# EAGLE design usb2hkx_v1.0 (EAGLE 6.6.0)
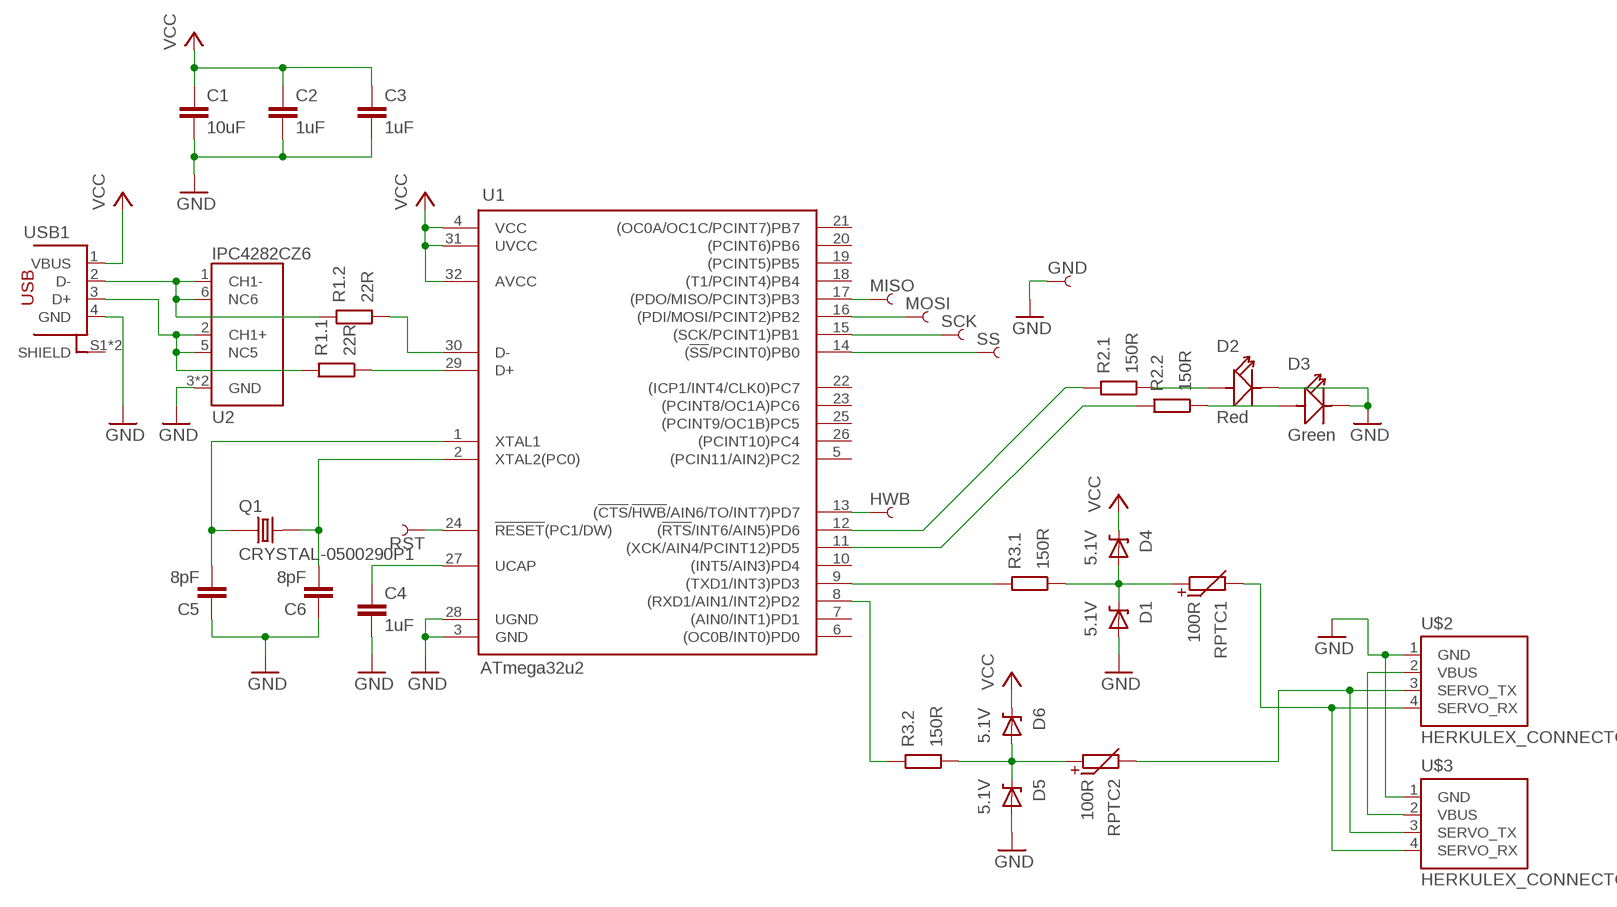
[diagram p0: schematic, sheet 1]

## Parts
C1  10uF  C0805_L  [0805_L]
C2  1uF  C0402  [0402_N]
C3  1uF  C0402  [0402_N]
C4  1uF  C0402  [0402_N]
C5  8pF  C0402  [0402_N]
C6  8pF  C0402  [0402_N]
D1  5.1V  DIODE_ZENER-923  [SOD-923_N]
D2  Red  LED  [LED0603]
D3  Green  LED  [LED0603]
D4  5.1V  DIODE_ZENER-923  [SOD-923_N]
D5  5.1V  DIODE_ZENER-923  [SOD-923_N]
D6  5.1V  DIODE_ZENER-923  [SOD-923_N]
GND  PIN_SMD_2X2.5  [PIN_SMD_2X2.5]
HWB  PIN_SMD_2X2.5  [PIN_SMD_2X2.5]
MISO  PIN_SMD_2X2.5  [PIN_SMD_2X2.5]
MOSI  PIN_SMD_2X2.5  [PIN_SMD_2X2.5]
Q1  CRYSTAL-0500290P1  [2P-SMD-5.0X3.2]
R1  22R  R_2-0402  [ARRAY_0402_65P_2_N]
R2  150R  R_2-0402  [ARRAY_0402_65P_2_N]
R3  150R  R_2-0402  [ARRAY_0402_65P_2_N]
RPTC1  100R  R-PTC0603  [0603_N]
RPTC2  100R  R-PTC0603  [0603_N]
RST  PIN_SMD_2X2.5  [PIN_SMD_2X2.5]
SCK  PIN_SMD_2X2.5  [PIN_SMD_2X2.5]
SS  PIN_SMD_2X2.5  [PIN_SMD_2X2.5]
U1  ATmega32u2  IC_ATMEGAXXU2-MU_L_MOD  [QFN-32_50P_L_MOD]
U2  IPC4282CZ6  [XSON6_N]
U$2  HERKULEX_CONNECTOR  [YW200-04]
U$3  HERKULEX_CONNECTOR  [YW200-04]
USB1  USB-STANDARD-PLUG_A_THT  [USB-A-THT]

## Nets
GND: C1.2 C2.2 C3.2 C4.2 C5.1 C6.1 D1.A D2.- D3.- D5.A GND.PIN U1.3(GND) U1.28(UGND) U2.3(GND) U2.4(GND) U$2.1(GND) U$3.1(GND) USB1.4(GND)
HWB: HWB.PIN U1.13((!CTS!/!HWB!/AIN6/TO/INT7)PD7)
N$1: R3.3 U1.9((TXD1/INT3)PD3)
N$2: R3.4 U1.8((RXD1/AIN1/INT2)PD2)
N$3: C4.1 U1.27(UCAP)
N$4: R2.3 U1.12((!RTS!/INT6/AIN5)PD6)
N$5: R2.4 U1.11((XCK/AIN4/PCINT12)PD5)
N$6: D1.C D4.A R3.2 RPTC1.1
N$7: C6.2 Q1.2 U1.2(XTAL2(PC0))
N$8: C5.2 Q1.1 U1.1(XTAL1)
N$9: R1.1 U1.30(D-)
N$10: R1.2 U1.29(D+)
N$11: R1.4 U2.1(CH1-) U2.6(NC6) USB1.2(D-)
N$12: R1.3 U2.2(CH1+) U2.5(NC5) USB1.3(D+)
N$14: D2.+ R2.2
N$15: U$2.2(VBUS) U$3.2(VBUS)
N$16: D3.+ R2.1
N$17: MISO.PIN U1.17((PDO/MISO/PCINT3)PB3)
N$18: MOSI.PIN U1.16((PDI/MOSI/PCINT2)PB2)
N$19: SCK.PIN U1.15((SCK/PCINT1)PB1)
N$20: SS.PIN U1.14((!SS!/PCINT0)PB0)
N$21: D5.C D6.A R3.1 RPTC2.1
RST: RST.PIN U1.24(!RESET!(PC1/DW))
RX: RPTC1.2 U$2.4(SERVO_RX) U$3.4(SERVO_RX)
TX: RPTC2.2 U$2.3(SERVO_TX) U$3.3(SERVO_TX)
VCC: C1.1 C2.1 C3.1 D4.C D6.C U1.4(VCC) U1.31(UVCC) U1.32(AVCC) USB1.1(VBUS)
Unconnected: U1.5((PCIN11/AIN2)PC2) U1.6((OC0B/INT0)PD0) U1.7((AIN0/INT1)PD1) U1.10((INT5/AIN3)PD4) U1.18((T1/PCINT4)PB4) U1.19((PCINT5)PB5) U1.20((PCINT6)PB6) U1.21((OC0A/OC1C/PCINT7)PB7) U1.22((ICP1/INT4/CLK0)PC7) U1.23((PCINT8/OC1A)PC6) U1.25((PCINT9/OC1B)PC5) U1.26((PCINT10)PC4) USB1.S1(SHIELD) USB1.S2(SHIELD)

## Library data of the parts
C1-C6 = Xevelabs:C: Non-polarized Capacitor
D1 D4-D6 = Xevelabs:DIODE_ZENER: Zener Diode
D2 D3 = OPL:LED*: LED
GND HWB MISO MOSI RST SCK SS = Xevelabs:PIN
Q1 = OPL:CRYSTAL*
R1-R3 = Xevelabs:R_2: Resistor Array of 2.
RPTC1 RPTC2 = Xevelabs:R-PTC: PTC (Positive Temperature Coefficient) Resistor
U1 = Xevelabs:IC_ATMEGAXXU2
U2 = Xevelabs:IPC4282CZ6: IPC4282CZ6 ESD suppressor from NXP
U$2 U$3 = Xevelabs:HERKULEX_CONNECTOR
USB1 = Xevelabs:USB-STANDARD: USB (4 pins) connectors, plugs and receptacles.

## Board
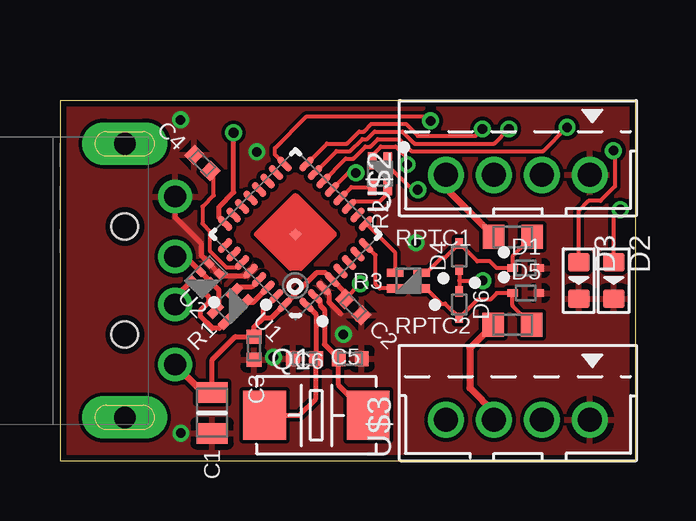
[diagram p1: board, top side]
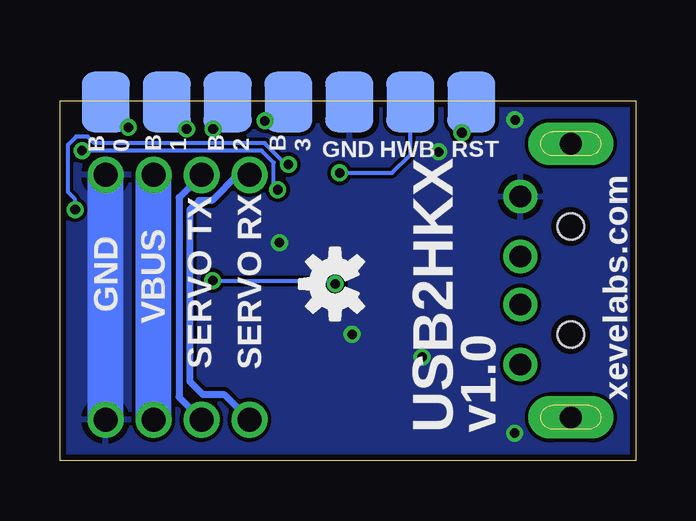
[diagram p2: board, bottom side, seen from below]

Size 24 x 15 mm. Coordinates in mm from the lower left corner, seen from the top.
Outline: 0,15 0,0 24,0 24,15 0,15
Copper layers (1*16): Top 0.035mm / dielectric 1.5mm / Bottom 0.035mm
Design rules "Fusion_eagle_rule_v1.1 *": minimum track width 6mil, minimum drill 12mil, track to track 6mil, track to pad 6mil, pad to pad 6mil, via to via 6mil, smd to smd 0mil, copper to edge 10mil, drill to drill 10mil, minimum pad ring 10mil, minimum via ring 6mil, stop-mask expansion 2mil, vias tented up to drill 100mil, thermal gap 10mil

### Footprints (pad centres in the part's own frame; a part is rotated, then mirrored left to right if it is on the bottom)
0805_L = smd 0.85 x 1.3: 1 -0.85,0; 2 0.85,0
0402_N = smd 0.57 x 0.62: 1 -0.48,0; 2 0.48,0
SOD-923_N = smd 0.43 x 0.32: A 0.55,0; C -0.55,0
LED0603 = smd 0.762 x 0.889: + -0.762,0; - 0.762,0
PIN_SMD_2X2.5 = smd 2.5 x 2: PIN 0,0
2P-SMD-5.0X3.2 = smd 1.778 x 2.032: 1 -2.159,0; 2 2.159,0
ARRAY_0402_65P_2_N = smd 0.7 x 0.35: 1 -0.55,0.325; 2 -0.55,-0.325; 3 0.55,-0.325; 4 0.55,0.325
0603_N = smd 0.9 x 1: 1 -0.8,0; 2 0.8,0
QFN-32_50P_L_MOD = smd 0.75 x 0.3: 1 -2.4,1.75; 2 -2.4,1.25; 3 -2.4,0.75; 4 -2.4,0.25; 5 -2.4,-0.25; 6 -2.4,-0.75; 7 -2.4,-1.25; 8 -2.4,-1.75; 17 2.4,-1.75; 18 2.4,-1.25; 19 2.4,-0.75; 20 2.4,-0.25; 21 2.4,0.25; 22 2.4,0.75; 23 2.4,1.25; 24 2.4,1.75 | smd 0.3 x 0.75: 9 -1.75,-2.4; 10 -1.25,-2.4; 11 -0.75,-2.4; 12 -0.25,-2.4; 13 0.25,-2.4; 14 0.75,-2.4; 15 1.25,-2.4; 16 1.75,-2.4; 25 1.75,2.4; 26 1.25,2.4; 27 0.75,2.4; 28 0.25,2.4; 29 -0.25,2.4; 30 -0.75,2.4; 31 -1.25,2.4; 32 -1.75,2.4 | smd 0.35 x 0.35: 33 0,0
XSON6_N = smd 0.35 x 0.3: 1 -0.3,0.5; 2 -0.3,0; 3 -0.3,-0.5; 4 0.3,-0.5; 5 0.3,0; 6 0.3,0.5
YW200-04 = drill 1: 1 0,-3; 2 0,-1; 3 0,1; 4 0,3
USB-A-THT = drill 0.9: 1 2.1,-3.5; 2 2.1,-1; 3 2.1,1; 4 2.1,3.5 | drill 0.9 pad 1.778 long: S1 0,5.7; S2 0,-5.7 | hole 1.1: 0,-2.25; 0,2.25

### Placement (x,y rotation side)
C1  6.34,1.99 270 top
C2  12.23,6.39 315 top
C3  8.09,4.68 270 top
C4  5.93,12.4 135 top
C5  10.2,4.25 0 top
C6  12.1,4.25 180 top
D1  19.42,8.02 0 top
D2  23.09,7.5 270 top
D3  21.63,7.5 270 top
D4  16.65,8.5 90 top
D5  19.42,6.98 0 top
D6  16.65,6.5 270 top
GND  11.93,14.94 90 bottom
HWB  9.39,14.94 90 bottom
MISO  14.47,14.94 270 bottom
MOSI  17.01,14.94 270 bottom
Q1  10.69,1.89 0 top
R1  7.1,6.42 225 top
R2  13.34,11.95 270 top
R3  14.53,7.5 180 top
RPTC1  18.88,9.32 180 top
RPTC2  18.87,5.66 180 top
RST  6.85,14.94 90 bottom
SCK  19.55,14.94 270 bottom
SS  22.09,14.94 270 bottom
U1  9.82,9.42 135 top
U2  6.08,7.65 135 top
U$1  [OSHW-LOGO-S]  12.53,7.36 90 bottom
U$2  19.1,11.9 90 top
U$3  19.1,1.7 90 top
USB1  2.7,7.5 0 top

### Tracks (layer width: path | path; a pad name or v marks a point on that pad's centre or on a via)
GND  (via drill 0.4)
  Top 0.2: U1.3 11.21,6.96 11.21,6.61 11.71,6.12 | U1.28 7.72,7.67 6.77,7.67 U2.3 U2.4 5.9,8.54 5.9,9.04 4.8,10.14 USB1.4 | C2.2 12.4,5.88
  Bottom 1.5: U$3.1 U$2.1
  other vias: 8.9,4.31 11.81,5.25 8.21,12.86 14.85,9.08 5.03,14.2 5.04,1.14
  pour Bottom: -1.11,15.61 25.41,15.61 25.46,-0.95 -1.11,-0.93
  pour Top: -0.34,15.5 -0.34,-0.64 25,-0.52 25.21,15.89
HWB  (via drill 0.4)
  Top 0.16: U1.13 12.03,11.98 v12.34,11.98
  Bottom 0.16: v12.34,11.98 10.15,11.98 9.39,12.74 HWB.PIN
N$1
  Top 0.16: R3.3 13.98,8.65 U1.9
N$2
  Top 0.16: R3.4 13.32,7.17 13.16,7.34 13.16,8.55 U1.8
N$3
  Top 0.16: U1.27 | U1.27 7.38,8.04 6.95,8.04 6.26,8.72 6.26,9.54 6.27,9.54 5.94,9.87 5.94,10.58 6.41,11.05 6.41,11.92 C4.1
N$4
  Top 0.16: U1.12 12.15,11.39 R2.3
N$5
  Top 0.16: U1.11 12.27,10.81 13.35,10.81 13.66,11.12 R2.4
N$6
  Top 0.16: RPTC1.1 18.87,8.51 D1.C 18.21,8.02 17.93,8.3 17.4,8.3 D4.A 16.07,8.47 15.93,8.47 15.29,7.83 R3.2
N$7
  Top 0.2: U1.2 10.85,6.63 10.85,6.47 11.03,6.29 11.03,4.84 C6.2 11.62,3.14 12.85,1.91 Q1.2
N$8
  Top 0.2: U1.1 10.68,6.09 C5.2 10.67,2.58 9.97,1.89 Q1.1
N$9
  Top 0.2: U1.30 8.04,6.58 R1.1
N$10
  Top 0.2: U1.29 7.98,7.23 7.45,7.23 R1.2
N$11
  Top 0.2: R1.4 6.65,5.51 6.36,5.51 5.85,6.02 5.85,6.24 6.19,6.58 6.19,6.83 U2.1 U2.6 4.8,6.79 USB1.2
N$12
  Top 0.2: R1.3 6.62,6.4 6.62,7.11 U2.2 U2.5 5.23,8.5 USB1.3
N$14  (via drill 0.4)
  Top 0.16: R2.2 13.02,12.71 13.38,13.08 14.01,13.08 14.47,12.62 v14.47,12.34 | D2.+ 23.09,10.18 v23.36,10.46
  Bottom 0.16: v14.47,12.34 14.56,12.34 15.46,13.23 22.57,13.23 22.84,13.5 23.32,13.5 23.66,13.16 23.66,11.18 23.36,10.88 v23.36,10.46
N$15
  Bottom 1.5: U$3.2 U$2.2
N$16  (via drill 0.4)
  Top 0.16: R2.1 13.66,12.31 14.69,11.29 v14.92,11.29 | v23.08,12.91 23.14,12.85 23.14,11.43 22.54,10.81 22.04,10.81 21.63,10.4 D3.+
  Bottom 0.16: v14.92,11.29 15.09,11.45 15.09,12.41 15.59,12.91 v23.08,12.91
N$17  (via drill 0.4)
  Top 0.16: U1.17 8.96,12.75 8.96,13.02 10.29,14.35 15.27,14.35 v15.46,14.15
  Bottom 0.16: v15.46,14.15 15.26,14.15 MISO.PIN
N$18  (via drill 0.4)
  Top 0.16: U1.16 11.13,13.21 11.96,13.21 12.47,13.71 12.67,13.71 12.98,14.03 14.42,14.03 14.92,13.53 17.32,13.53 v17.61,13.81
  Bottom 0.16: v17.61,13.81 17.61,14.34 MOSI.PIN
N$19  (via drill 0.4)
  Top 0.16: U1.15 11.52,12.89 12.1,12.89 12.61,13.39 12.8,13.39 13.12,13.71 14.29,13.71 14.79,13.21 18.11,13.21 v18.72,13.81
  Bottom 0.16: v18.72,13.81 18.72,14.11 SCK.PIN
N$20  (via drill 0.4)
  Top 0.16: U1.14 11.91,12.57 12.23,12.57 12.73,13.08 12.94,13.08 13.26,13.39 14.15,13.39 14.66,12.89 20.16,12.89 v21.14,13.88
  Top 0.2: U1.14
  Bottom 0.16: SS.PIN 21.14,13.99 v21.14,13.88
N$21
  Top 0.16: RPTC2.1 18.87,6.46 D5.C 18.21,6.98 17.94,6.71 17.41,6.71 D6.A 16.06,6.54 15.9,6.54 15.27,7.17 R3.1
RST  (via drill 0.4)
  Top 0.2: U1.24 6.63,10.13 6.63,10.56 7.24,11.17 v7.24,13.66
  Bottom 0.2: v7.24,13.66 7.24,14.07 6.85,14.46 RST.PIN
RX
  Top 0.3: RPTC1.2 18.08,9.37 16.1,11.35 U$2.4
  Bottom 0.3: U$2.4 16.59,11.9 17.66,10.84 18.2,10.84 18.59,10.45 18.59,3.29 18.05,2.76 17.16,2.76 U$3.4
TX
  Top 0.3: RPTC2.2 17.09,4.68 17.09,3.03 18.1,2.02 U$3.3
  Bottom 0.3: U$2.3 19.04,10.96 19.04,2.64 U$3.3
VCC  (via drill 0.4)
  Top 0.16: D4.C 16.65,7.5 | 16.65,7.5 D6.C | 16.65,7.5 v17.63,7.5 | v12.52,7.36 C2.1
  Top 0.2: C2.1 11.89,7 U1.4 11.06,7.83 10.71,7.83 U1.32 8.83,5.96 8.48,5.96 | 8.48,5.96 8.48,6.32 U1.31 | C1.1 6.34,4.2 7.31,5.16 C3.1 8.09,5.57 8.48,5.96
  Top 0.3: USB1.1 5.96,2.83 C1.1
  Bottom 0.16: v17.63,7.5 12.66,7.5 v12.52,7.36

### Text on the board
bPlace: RST | HWB | GND | B / 3 | B / 2 | B / 1 | B / 0 | VBUS | GND | SERVO RX | SERVO TX | xevelabs.com | v1.0 | USB2HKX